# Altium schematic sheet Schematic.SchDoc
size A4
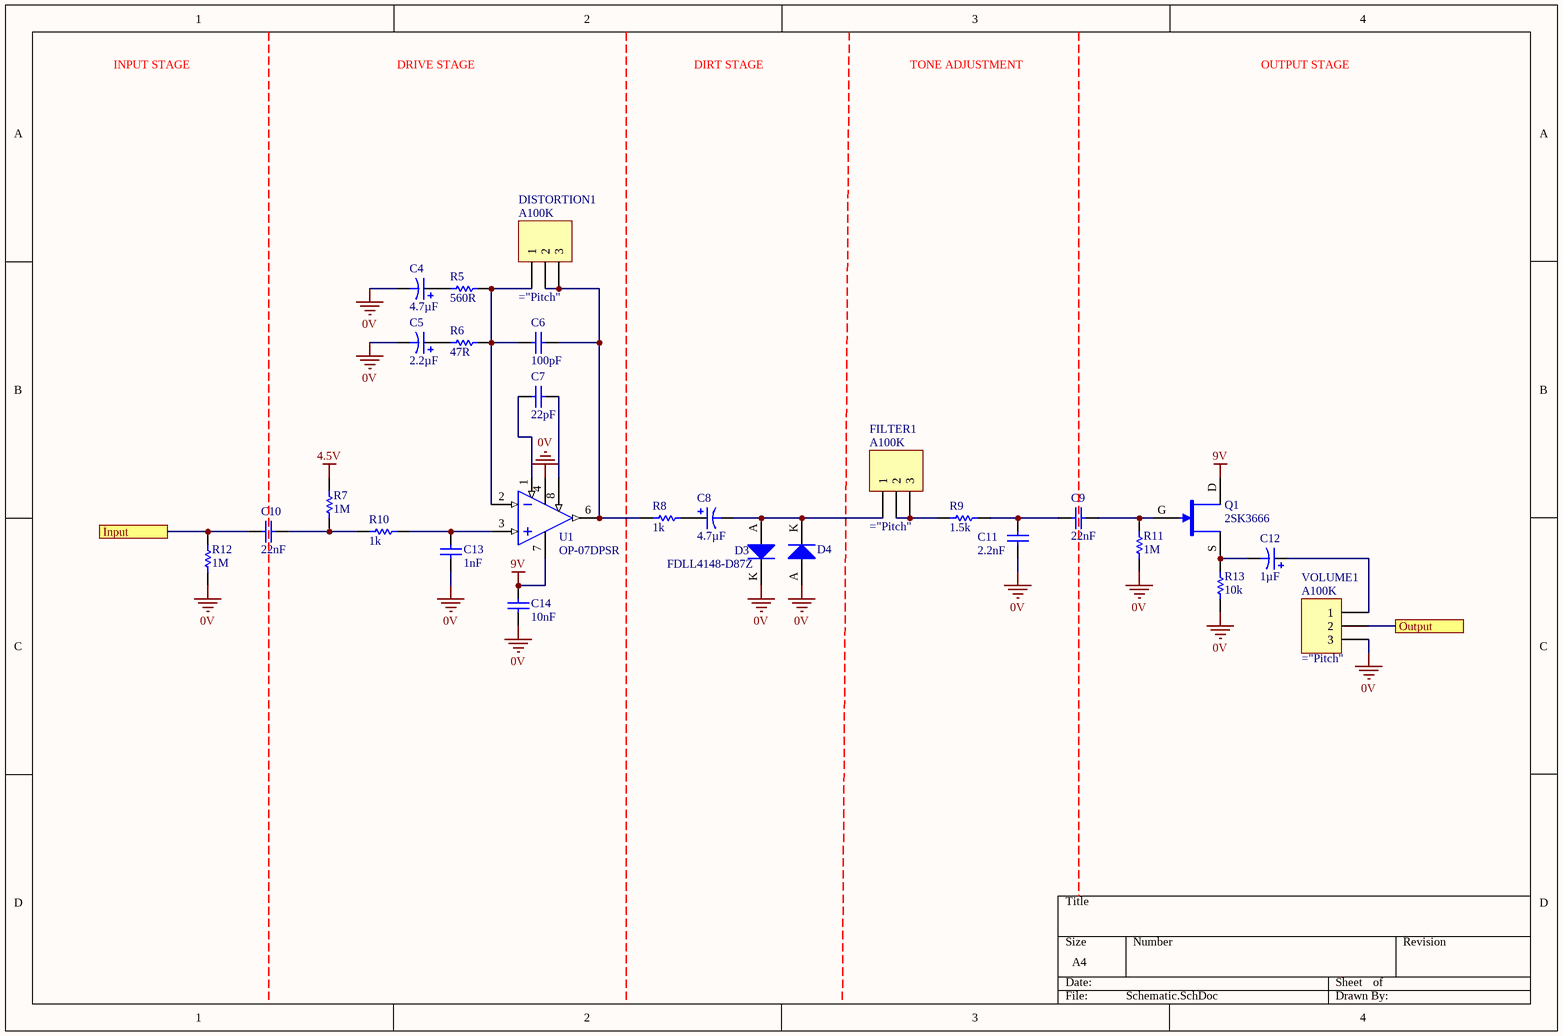
[diagram p0: Schematic.SchDoc]

## Parts
C4  4.7µF  [1206]
C5  2.2µF  [1206]
C6  100pF  [0805]
C7  22pF  [0805]
C8  4.7µF  [1206]
C9  22nF  [0805]
C10  22nF  [0805]
C11  2.2nF  [0805]
C12  1µF  [1206]
C13  1nF  [0805]
C14  10nF  [0805]
D3  FDLL4148-D87Z  [SOD-80 Diode]
D4  FDLL4148-D87Z  [SOD-80 Diode]  (value not drawn)
DISTORTION1  Resistance: A100K  [TH 2.54mm Header 1x3]
FILTER1  Resistance: A100K  [TH 2.54mm Header 1x3]
Q1  2SK3666  [ON SOT-23 JFET]
R5  560R  [0805]
R6  47R  [0805]
R7  1M  [0805]
R8  1k  [0805]
R9  1.5k  [0805]
R10  1k  [0805]
R11  1M  [0805]
R12  1M  [0805]
R13  10k  [0805]
U1  OP-07DPSR  [TI 8-SOIC]
VOLUME1  Resistance: A100K  [TH 2.54mm Header 1x3]

## Ports
Input, Output

## Nets
0V: C4.1 C5.1 C11.1 C13.1 C14.1 D3.K D4.A R11.1 R12.1 R13.1 U1.4(VCC-) VOLUME1.3
4.5V: R7.2
9V: C14.2 Q1.D U1.7(VCC+)
Input: C10.1 R12.2 ; port Input
Output: VOLUME1.2 ; port Output
NetC4_2: C4.2 R5.1
NetC5_2: C5.2 R6.1
NetC6_1: C6.1 DISTORTION1.1 R5.2 R6.2 U1.2(IN-)
NetC6_2: C6.2 DISTORTION1.2 DISTORTION1.3 R8.1 U1.6(OUT)
NetC7_1: C7.1 U1.1(OFFSET_N1)
NetC7_2: C7.2 U1.8(OFFSET_N2)
NetC8_1: C8.1 D3.A D4.K FILTER1.1
NetC8_2: C8.2 R8.2
NetC9_1: C9.1 C11.2 R9.2
NetC9_2: C9.2 Q1.G R11.2
NetC10_2: C10.2 R7.1 R10.1
NetC12_1: C12.1 Q1.S R13.2
NetC12_2: C12.2 VOLUME1.1
NetC13_2: C13.2 R10.2 U1.3(IN+)
NetFILTER1_2: FILTER1.2 FILTER1.3 R9.1

## Notes on the sheet
- INPUT STAGE
- DRIVE STAGE
- DIRT STAGE
- TONE ADJUSTMENT
- OUTPUT STAGE

## Library data of the parts
C4 C8 = TAJA475K025RNJ: Manufacturer: AVX Corporation; Tolerance: ±10%; Material: Tantalum; Rated Voltage: 25V; Part Number: TAJA475K025RNJ; Value: 4.7µF; Digikey Part Number: 478-11053-1-ND
C5 = TAJA225K025RNJ: Manufacturer: AVX Corporation; Tolerance: ±10%; Material: Tantalum; Rated Voltage: 25V; Part Number: TAJA225K025RNJ; Value: 2.2µF; Digikey Part Number: 478-1662-1-ND
C6 = GCM2165C1H101JA16D: Manufacturer: muRata; Tolerance: ±5%; Material: C0G, NP0; Rated Voltage: 50V; Part Number: GCM2165C1H101JA16D; Value: 100pF; Digikey Part Number: 490-8031-1-ND
C7 = GRM21A5C2E220JW01D: Manufacturer: muRata; Tolerance: ±5%; Material: C0G, NP0; Rated Voltage: 250V; Part Number: GRM21A5C2E220JW01D; Value: 22pF; Digikey Part Number: 490-5534-1-ND
C9 C10 = GCM21B5C1H223JA16L: Manufacturer: muRata; Tolerance: ±5%; Material: C0G, NP0; Rated Voltage: 50V; Part Number: GCM21B5C1H223JA16L; Value: 22nF; Digikey Part Number: 490-5318-1-ND
C11 = GCM2165C1H222JA16D: Manufacturer: muRata; Tolerance: ±5%; Material: C0G, NP0; Rated Voltage: 50V; Part Number: GCM2165C1H222JA16D; Value: 2.2nF; Digikey Part Number: 490-8033-1-ND
C12 = TAJA105K025RNJ: Manufacturer: AVX Corporation; Tolerance: ±10%; Material: Tantalum; Rated Voltage: 25V; Part Number: TAJA105K025RNJ; Value: 1µF; Digikey Part Number: 478-2363-1-ND
C13 = GCM2165C1H102JA16D: Manufacturer: muRata; Tolerance: ±5%; Material: C0G, NP0; Rated Voltage: 50V; Part Number: GCM2165C1H102JA16D; Value: 1nF; Digikey Part Number: 490-8032-1-ND
C14 = GCM2195C1H103JA16D: Manufacturer: muRata; Tolerance: ±5%; Material: C0G, NP0; Rated Voltage: 50V; Part Number: GCM2195C1H103JA16D; Value: 10nF; Digikey Part Number: 490-4783-1-ND
D3 D4 = FDLL4148-D87Z: DIODE GEN PURP 100V 200MA SOD80; Manufacturer: On Semiconductor; Part Number: FDLL4148-D87Z; Digikey Part Number: FDLL4148-D87ZCT-ND; Digikey Link: https://www.digikey.com/product-detail/en/on-semiconductor/FDLL4148-D87Z/FDLL4148-D87ZCT-ND/3042567
DISTORTION1 FILTER1 VOLUME1 = TH 2.54mm Header 1x3: Part Number: A100K POT; Positions: 3
Q1 = 2SK3666: JFET N-Channel 10mA 200mW Surface Mount 3-CP; Manufacturer: ON Semiconductor; Published: 24-Mar-1999; LatestRevisionDate: 29-May-2009; LatestRevisionNote: IPC-7351 Footprint Added.; PackageVersion: Sep-2000; PackageReference: SOT-343; Publisher: Altium Limited; PackageDescription: 4-Pin SOT-343 Package 1.3 mm Pitch, 2.1 mm Lead Span; Part Number: 2SK3666; Digikey Part Number: 869-1107-1-ND; Digikey Link: https://www.digikey.com/product-detail/en/on-semiconductor/2SK3666-3-TB-E/869-1107-1-ND/2165585
R5 = RC0805FR07560RL: Manufacturer: YAGEO; Tolerance: 0.01; Rated Voltage: 0.125W; Part Number: RC0805FR07560RL; Value: 560R; Material: FR-07; Digikey Part Number: 311-560CRCT-ND
R6 = RC0805FR0747RL: Manufacturer: YAGEO; Tolerance: 0.01; Rated Voltage: 0.125W; Part Number: RC0805FR0747RL; Value: 47R; Material: FR-07; Digikey Part Number: 311-47.0CRCT-ND
R7 R11 R12 = RC0805FR071ML: Manufacturer: YAGEO; Tolerance: 0.01; Rated Voltage: 0.125W; Part Number: RC0805FR071ML; Value: 1M; Material: FR-07; Digikey Part Number: 311-1.00MCRCT-ND
R8 R10 = RC0805FR071KL: Manufacturer: YAGEO; Tolerance: 0.01; Rated Voltage: 0.125W; Part Number: RC0805FR071KL; Value: 1k; Material: FR-07; Digikey Part Number: 311-1.00KCRCT-ND
R9 = RC0805FR071K5L: Manufacturer: YAGEO; Tolerance: 0.01; Rated Voltage: 0.125W; Part Number: RC0805FR071K5L; Value: 1.5k; Material: FR-07; Digikey Part Number: 311-1.50KCRCT-ND
R13 = RC0805FR0710KL: Manufacturer: YAGEO; Tolerance: 0.01; Rated Voltage: 0.125W; Part Number: RC0805FR0710KL; Value: 10k; Material: FR-07; Digikey Part Number: 311-10.0KCRCT-ND
U1 = OP-07DPSR: General Purpose Amplifier 1 Circuit 8-SO; Manufacturer: Texas Instruments; Part Number: OP-07DPSR; Digikey Part Number: 296-14171-2-ND; Digikey Link: https://www.digikey.com/product-detail/en/texas-instruments/OP-07DPSR/296-14171-2-ND/525998